# Altium schematic sheet Batt_Charger.SchDoc: Battery Charging
size A4; Organization: Altium Limited; Address1: L3, 12a Rodborough Rd; Address2: Frenchs Forest; Address3: NSW; Address4: Australia 2086
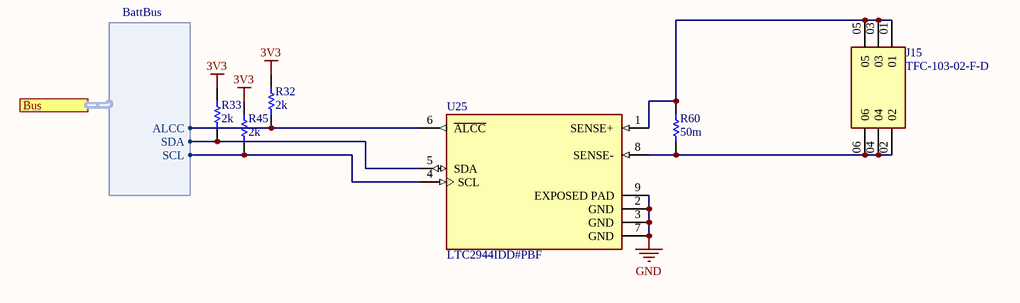
[diagram p0: Batt_Charger.SchDoc]

## Parts
J15  TFC-103-02-F-D  [SAMTEC_TFC-103-02-F-D]
R32  2k  [0402_Res]
R33  2k  [0402_Res]
R45  2k  [0402_Res]
R60  50m  [STD_0805_R]
U25  LTC2944IDD#PBF  [FP-DD-8-05-08-1698-MFG]

## Ports
Bus (harness BattBus)

## Harnesses
BattBus: ALCC, SDA, SCL

## Nets
3V3: R32.2 R33.2 R45.2
GND: U25.2(GND) U25.3(GND) U25.7(GND) U25.9(EXPOSED_PAD)
NetJ15_01: J15.01 J15.03 J15.05 R60.2 U25.1(SENSE+)
NetJ15_02: J15.02 J15.04 J15.06 R60.1 U25.8(SENSE-)
NetR32_1: R32.1 U25.6(~{ALCC}) ; port Bus.ALCC
NetR33_1: R33.1 U25.5(SDA) ; port Bus.SDA
NetR45_1: R45.1 U25.4(SCL) ; port Bus.SCL

## Notes on the sheet
- Title
- Date:
- RE:
- Arturo di Girolamo
- Size:
- A3
- A

## Library data of the parts
J15 = TFC-103-02-F-D: MF: Samtec; Value: *; Availability: Unavailable; MP: TFC-103-02-F-D; Price: None; Package: None; ASYPN: TFC-103-02-F-D
R32 R33 R45 = RNCP0805FTD1K00: 1K 1% 1/4W; ASYPN: RMCF0402FT2K00; Value: 1K; MFGPN: RNCP0805FTD1K00
R60 = RNCP0805FTD1K00: 1K 1% 1/4W; ASYPN: UR73V2ATTD50L0F; Value: 1K; MFGPN: RNCP0805FTD1K00
U25 = CMP-09132-000003-1: IC BATTERY GAS GAUGE I2C 8DFN; Manufacturer: Analog Devices; Nominal Supply Current: 15-850uA; Max Supply Voltage: 60V; Number Of Cells: 1; Standoff Height: 0mm; Min Supply Voltage: 3.6V; Package: DD-8-05-08-1698; Mouser Description: LTC2944 - 60V Battery Gas Gauge with Temperature, Voltage and Current Measurement; Digikey Description: IC BATTERY GAS GAUGE I2C 8DFN; Device Class L1: Integrated Circuits (ICs); Automotive: No; Height: 0.8mm; Temperature: -40°C to +85°C; ComponentLink2Description: Datasheet; Number Of Outputs: 1; Octopart: https://octopart.com/ltc2944idd%23pbf-analog+devices-88318751; Ipc Land Pattern Name: DFN300X300X75-8; Temperature Range Low: -40°C; Lead Free: Yes; ComponentLink2URL: https://www.analog.com/media/en/technical-documentation/data-sheets/2944fa.pdf; Ambient Temperature Range Low: -40°C; Device Class L3: Battery Management; Category: IC; RoHS: TRUE; Manufacturer Part Number: LTC2944IDD#PBF; Ambient Temperature Range High: +85°C; Temperature Range High: +85°C; Device Class L2: Power Management ICs; ASYPN: LTC2944IDD#PBF